# EAGLE design Quectel-2560-v2.1 (EAGLE 7.6.0)
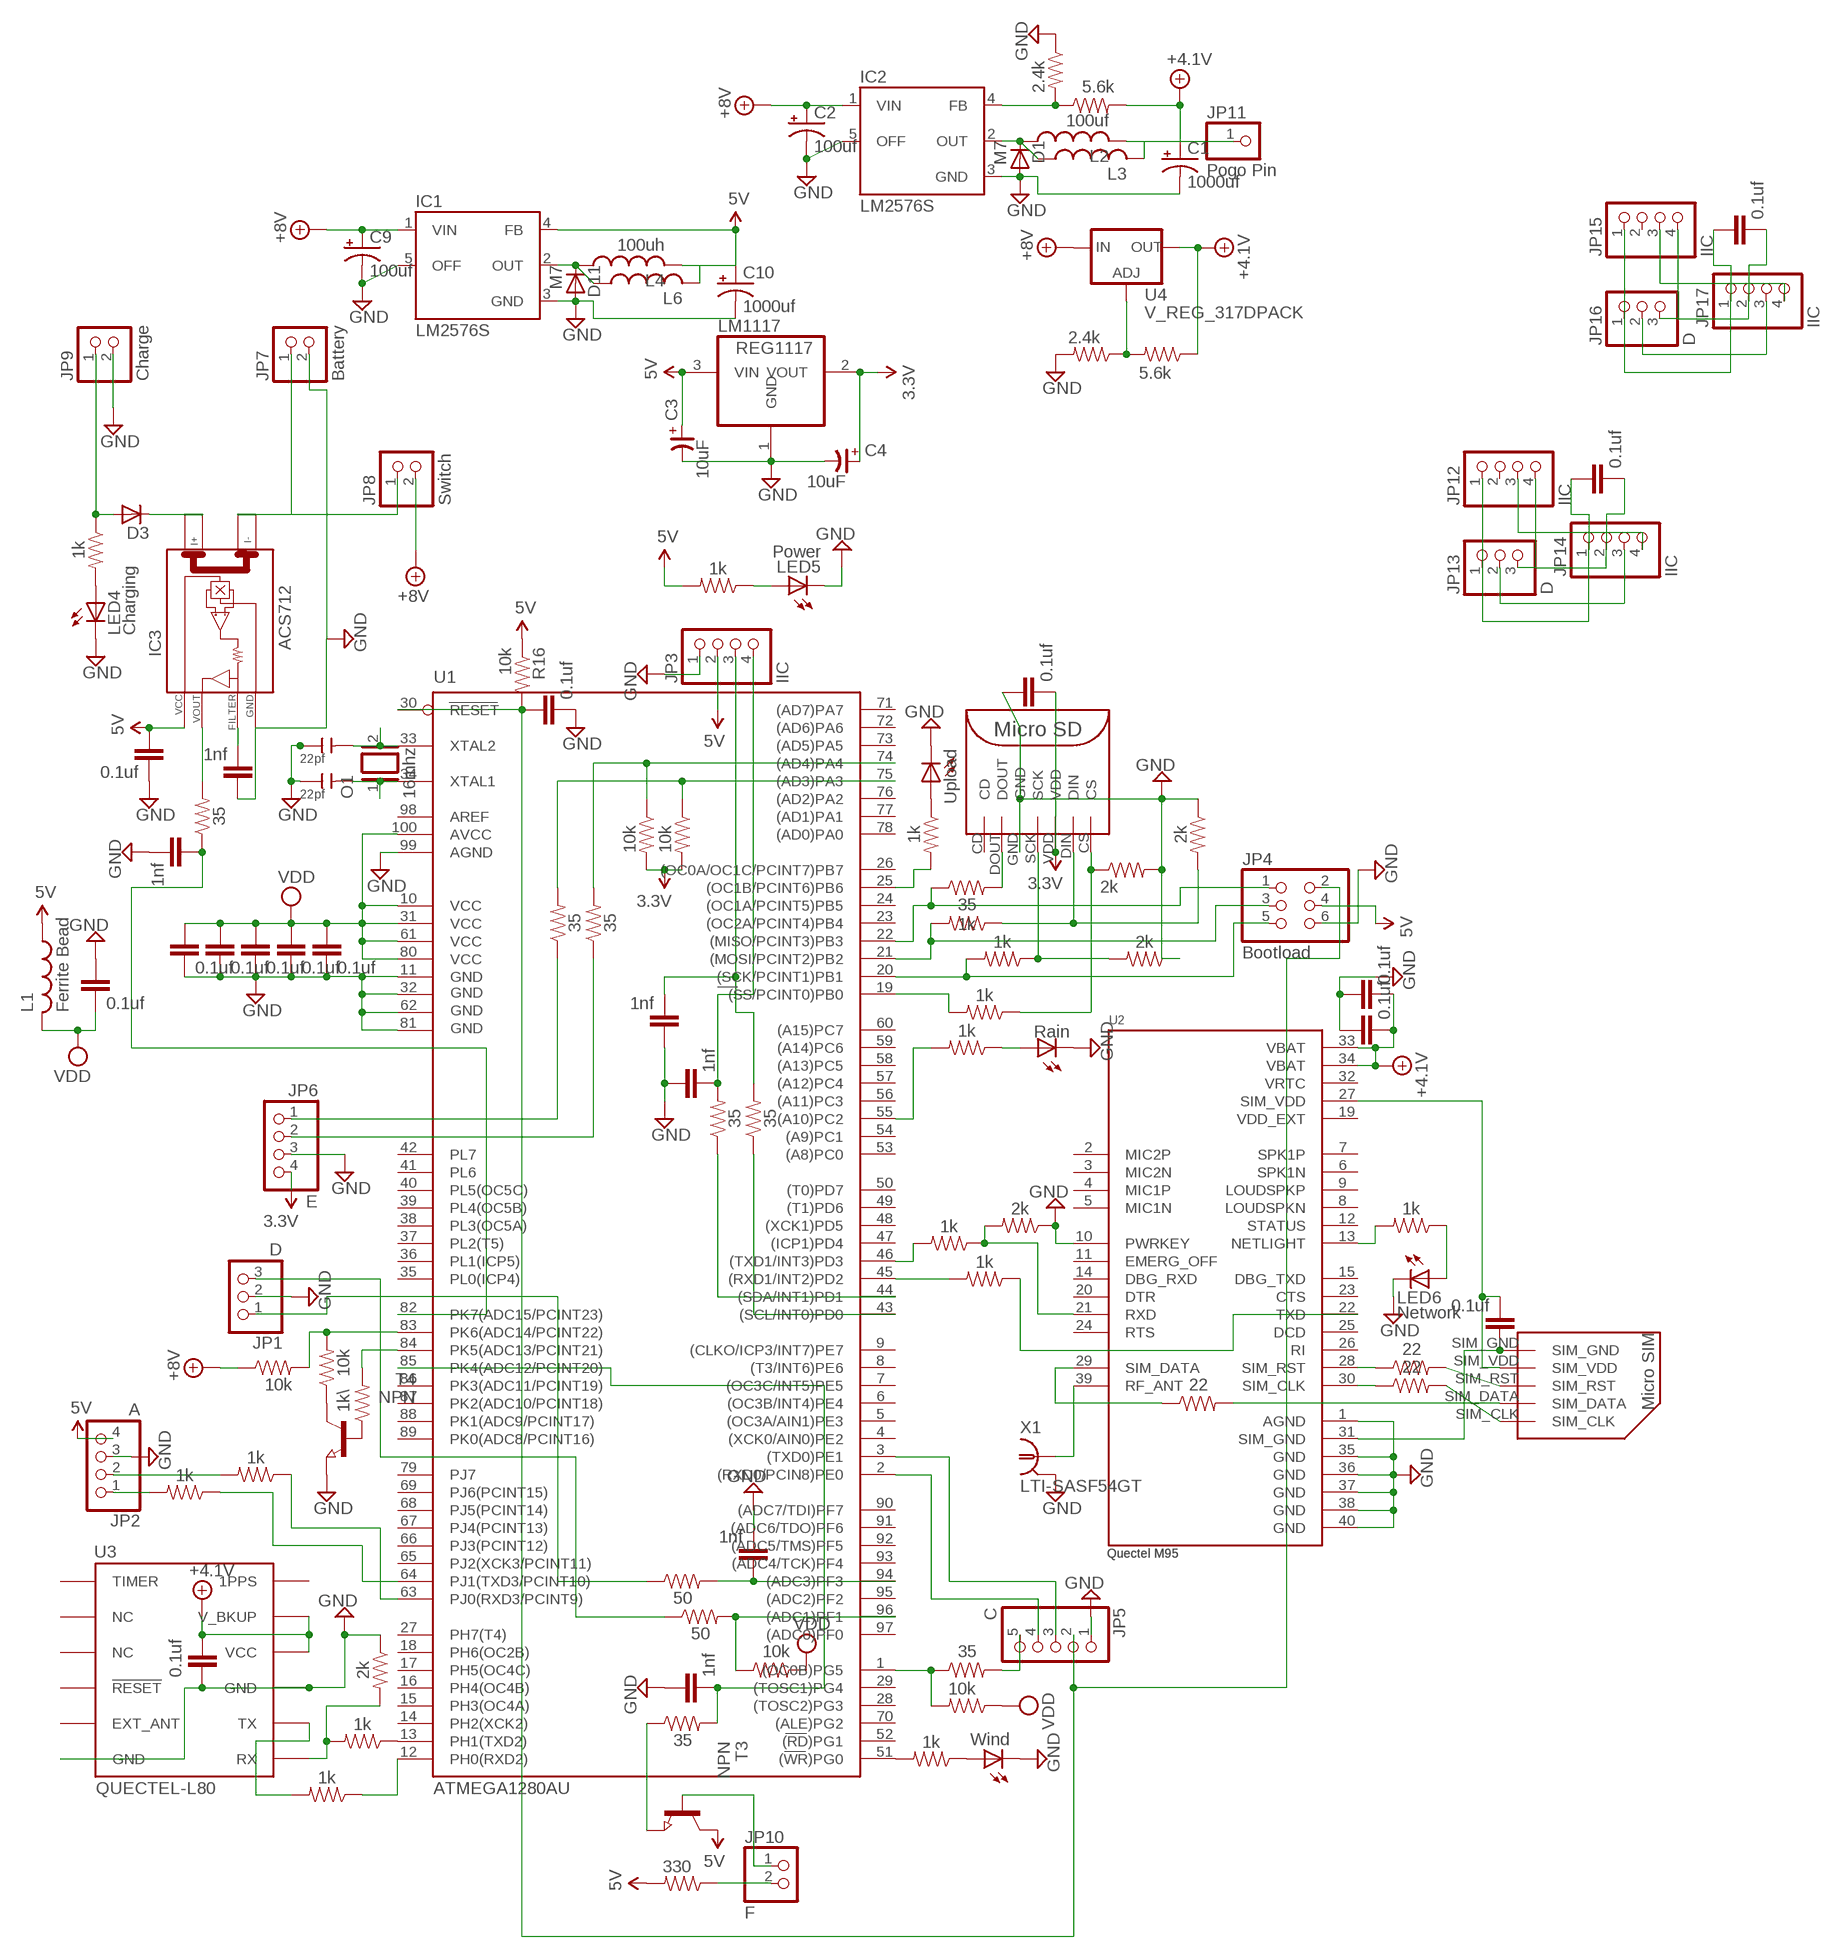
[diagram p0: schematic, sheet 1]

## Parts
C1  1000uf  CPOL-US153CLV-1012  [153CLV-1012]
C2  100uf  CPOL-USCT7343  [CT7343]
C3  10uF  CP-3528  [3528/T]
C4  10uF  CP-3528  [3528/T]
C7  22pf  CERAMIC-22PF-50V-5%-NPO(0805)  [C0805]
C8  22pf  CERAMIC-22PF-50V-5%-NPO(0805)  [C0805]
C9  100uf  CPOL-USCT7343  [CT7343]
C10  1000uf  CPOL-US153CLV-1012  [153CLV-1012]
D1  M7  BYS10  [SOD106A]
D3  BYS10  [SOD106A]
D11  M7  BYS10  [SOD106A]
DC1  0.1uf  C-EUC0805  [C0805]
DC2  0.1uf  C-EUC0805  [C0805]
DC3  0.1uf  C-EUC0805  [C0805]
DC4  0.1uf  C-EUC0805  [C0805]
DC5  0.1uf  C-EUC0805  [C0805]
DC6  0.1uf  C-EUC0805  [C0805]
DC7  0.1uf  C-EUC0805  [C0805]
DC8  0.1uf  C-EUC0805  [C0805]
DC9  0.1uf  C-EUC0805  [C0805]
DC10  0.1uf  C-EUC0805  [C0805]
DC11  0.1uf  C-EUC0805  [C0805]
DC12  1nf  C-EUC0805  [C0805]
DC13  1nf  C-EUC0805  [C0805]
DC14  1nf  C-EUC0805  [C0805]
DC15  0.1uf  C-EUC0805  [C0805]
DC16  0.1uf  C-EUC0805  [C0805]
DC17  1nf  C-EUC0805  [C0805]
DC18  0.1uf  C-EUC0805  [C0805]
DC19  0.1uf  C-EUC0805  [C0805]
DC20  1nf  C-EUC0805  [C0805]
DC21  1nf  C-EUC0805  [C0805]
IC1  LM2576S  [TO263-5]
IC2  LM2576S  [TO263-5]
IC3  ACS712  [SO08]
JP1  D  PINHD-1X3  [1X03]
JP2  A  PINHD-1X4  [1X04]
JP3  IIC  PINHD-1X4  [1X04]
JP4  Bootload  PINHD-2X3  [2X03]
JP5  C  PINHD-1X5  [1X05]
JP6  E  PINHD-1X4  [1X04]
JP7  Battery  PINHD-1X2  [1X02]
JP8  Switch  PINHD-1X2  [1X02]
JP9  Charge  PINHD-1X2  [1X02]
JP10  F  PINHD-1X2  [1X02]
JP11  Pogo Pin  PINHD-1X1  [1X01]
JP12  IIC  PINHD-1X4  [1X04]
JP13  D  PINHD-1X3  [1X03]
JP14  IIC  PINHD-1X4  [1X04]
JP15  IIC  PINHD-1X4  [1X04]
JP16  D  PINHD-1X3  [1X03]
JP17  IIC  PINHD-1X4  [1X04]
L1  Ferrite Bead  L-USL2012C  [L2012C]
L2  100uf  L-USPIS2816  [PIS2816]
L3  L-US6000-XXX-RC  [6000-XXXX-RC]
L4  100uh  L-USPIS2816  [PIS2816]
L6  L-US6000-XXX-RC  [6000-XXXX-RC]
LED1  Rain  LEDCHIP-LED0805  [CHIP-LED0805]
LED2  Upload  LEDCHIP-LED0805  [CHIP-LED0805]
LED3  Wind  LEDCHIP-LED0805  [CHIP-LED0805]
LED4  Charging  LEDCHIP-LED0805  [CHIP-LED0805]
LED5  Power  LEDCHIP-LED0805  [CHIP-LED0805]
LED6  Network  LEDCHIP-LED0805  [CHIP-LED0805]
LM1117  REG1117  [SOT223]
O1  16mhz  XTAL/S  [QS]
R1  35  RESISTOR0805-RES  [0805]
R4  2k  RESISTOR0805-RES  [0805]
R5  35  RESISTOR0805-RES  [0805]
R6  1k  RESISTOR0805-RES  [0805]
R7  1k  RESISTOR0805-RES  [0805]
R8  1k  RESISTOR0805-RES  [0805]
R9  2k  RESISTOR0805-RES  [0805]
R10  22  RESISTOR0805-RES  [0805]
R11  22  RESISTOR0805-RES  [0805]
R12  1k  RESISTOR0805-RES  [0805]
R13  1k  RESISTOR0805-RES  [0805]
R14  1k  RESISTOR0805-RES  [0805]
R15  1k  RESISTOR0805-RES  [0805]
R16  10k  RESISTOR0805-RES  [0805]
R17  1k  RESISTOR0805-RES  [0805]
R18  1k  RESISTOR0805-RES  [0805]
R19  35  RESISTOR0805-RES  [0805]
R20  10k  RESISTOR0805-RES  [0805]
R21  50  RESISTOR0805-RES  [0805]
R22  35  RESISTOR0805-RES  [0805]
R23  2k  RESISTOR0805-RES  [0805]
R24  2k  RESISTOR0805-RES  [0805]
R25  1k  RESISTOR0805-RES  [0805]
R26  1k  RESISTOR0805-RES  [0805]
R27  1k  RESISTOR0805-RES  [0805]
R28  1k  RESISTOR0805-RES  [0805]
R29  2k  RESISTOR0805-RES  [0805]
R30  35  RESISTOR0805-RES  [0805]
R31  50  RESISTOR0805-RES  [0805]
R32  1k  RESISTOR0805-RES  [0805]
R33  1k  RESISTOR0805-RES  [0805]
R34  10k  RESISTOR0805-RES  [0805]
R35  35  RESISTOR0805-RES  [0805]
R36  10k  RESISTOR0805-RES  [0805]
R39  35  RESISTOR0805-RES  [0805]
R40  10k  RESISTOR0805-RES  [0805]
R41  330  RESISTOR0805-RES  [0805]
R42  35  RESISTOR0805-RES  [0805]
R43  10k  RESISTOR0805-RES  [0805]
R44  10k  RESISTOR0805-RES  [0805]
R45  2.4k  RESISTOR0805-RES  [0805]
R46  5.6k  RESISTOR0805-RES  [0805]
R47  22  RESISTOR0805-RES  [0805]
R48  1k\  RESISTOR0805-RES  [0805]
R49  2.4k  RESISTOR0805-RES  [0805]
R50  5.6k  RESISTOR0805-RES  [0805]
T3  NPN  NPN-TRANSISTOR_SOT23  [SOT23]
T4  NPN  NPN-TRANSISTOR_SOT23  [SOT23]
U1  ATMEGA1280AU  ATMEGA2560AU  [TQFP100]
U2  Quectel M95  M95  [XCVR_M95]
U3  QUECTEL-L80  [QUECTEL-L80]
U4  V_REG_317DPACK  [V-REG_DPACK]
U$1  MICROSD  [MICROSD]
U$2  MICROSIM  [MICROSIM]
X1  LTI-SASF54GT  [LTI-SASF54GT]

## Nets
3.3V: C4.+ DC10.2 JP6.4 LM1117.2(VOUT) R34.2 R36.2 U$1.VDD
5V: C3.+ C10.+ DC19.2 IC1.4(FB) IC3.8(VCC) JP2.4 JP3.2 JP4.4 L1.1 L4.2 L6.2 LM1117.3(VIN) R16.1 R18.2 R41.2 T3.3(C)
+4.1V: C1.+ DC6.2 DC7.2 DC16.1 JP11.1 L2.2 L3.2 R46.2 R50.1 U2.33(VBAT) U2.34(VBAT) U3.4(VCC) U3.5(V_BKUP) U4.4(OUT)
+8V: C2.+ C9.+ IC1.1(VIN) IC2.1(VIN) JP8.2 R43.1 U4.3(IN)
GND: C1.- C2.- C3.- C4.- C7.1 C8.1 C9.- C10.- D1.A D11.A DC1.2 DC2.2 DC3.2 DC4.2 DC5.2 DC6.1 DC7.1 DC10.1 DC11.2 DC12.1 DC13.1 DC14.1 DC16.2 DC17.2 DC18.1 DC19.1 DC20.1 DC21.2 IC1.3(GND) IC1.5(OFF) IC2.3(GND) IC2.5(OFF) IC3.5(GND) JP1.2 JP2.3 JP3.1 JP4.6 JP5.1 JP6.3 JP7.2 JP9.2 LED1.C LED2.C LED3.C LED4.C LED5.C LED6.C LM1117.1(GND) R4.1 R9.1 R23.2 R24.1 R29.1 R45.1 R49.2 T4.2(E) U1.11(GND) U1.32(GND1) U1.62(GND2) U1.81(GND3) U1.99(AGND) U2.1(AGND) U2.10(PWRKEY) U2.35(GND) U2.36(GND) U2.37(GND) U2.38(GND) U2.40(GND) U3.3(GND) U3.12(GND) U$1.GND X1.2 X1.3 X1.4 X1.5
N$1: DC15.1 U2.31(SIM_GND) U$2.SIM_GND
N$2: DC15.2 U2.27(SIM_VDD) U$2.SIM_VDD
N$3: R10.1 U2.28(SIM_RST)
N$4: R11.1 U2.30(SIM_CLK)
N$5: DC8.1 JP12.1 JP13.1 JP14.1
N$6: R10.2 U$2.SIM_RST
N$7: LED2.A R25.1
N$8: JP5.4 U1.2((RXD0/PCIN8)PE0)
N$9: JP5.3 U1.3((TXD0)PE1)
N$10: R7.1 R24.2 U$1.SCK
N$11: DC12.2 JP3.4 R5.2
N$12: R6.1 R9.2 U$1.DIN
N$13: DC11.1 JP4.2 JP5.2 R16.2 U1.30(RESET)
N$14: DC8.2 JP12.4 JP13.3 JP14.2
N$15: JP13.2 JP14.3
N$16: JP4.3 R6.2 U1.21((MOSI/PCINT2)PB2)
N$17: JP4.5 R7.2 U1.20((SCK/PCINT1)PB1)
N$18: DC21.1 R1.1 U1.82(PK7(ADC15/PCINT23))
N$19: IC3.4(I-_1) JP7.1 JP8.1
N$20: R8.2 U1.19((SS/PCINT0)PB0)
N$21: U2.39(RF_ANT) X1.1
N$22: R22.2 R36.1 U1.75((AD3)PA3)
N$23: R5.1 U1.44((SDA/INT1)PD1)
N$25: D3.A JP9.1 R26.1
N$26: LED3.A R28.1
N$27: LED4.A R26.2
N$28: IC3.7(VOUT) R1.2
N$29: R11.2 U$2.SIM_CLK
N$30: C7.2 O1.2 U1.33(XTAL2)
N$31: C8.2 O1.1 U1.34(XTAL1)
N$32: DC13.2 JP3.3 R30.2
N$33: R28.2 U1.51((WR)PG0)
N$34: LED1.A R27.1
N$35: R8.1 R23.1 U$1.CS
N$36: R12.1 U1.13(PH1(TXD2))
N$37: R13.2 U3.2(TX)
N$38: R4.2 R12.2 U3.1(RX)
N$39: R25.2 U1.25((OC1B/PCINT6)PB6)
N$40: R14.2 U1.46((TXD1/INT3)PD3)
N$41: R15.2 U1.45((RXD1/INT2)PD2)
N$42: R14.1 R29.2 U2.21(RXD)
N$43: R15.1 U2.22(TXD)
N$44: R19.2 R34.1 U1.74((AD4)PA4)
N$45: JP5.5 R39.2
N$46: JP12.3 JP14.4
N$47: R20.1 R31.2 U1.96((ADC1)PF1)
N$48: R27.2 U1.55((A10)PC2)
N$49: JP4.1 R35.1 U1.22((MISO/PCINT3)PB3)
N$50: R17.2 U2.13(NETLIGHT)
N$51: LED6.A R17.1
N$52: JP6.1 R22.1
N$53: JP1.1 R21.1
N$54: DC17.1 R21.2 U1.94((ADC3)PF3)
N$55: R30.1 U1.43((SCL/INT0)PD0)
N$56: JP6.2 R19.1
N$57: JP1.3 R31.1
N$58: JP2.2 R32.2
N$60: LED5.A R18.1
N$61: JP10.2 R41.1
N$62: R32.1 U1.63(PJ0(RXD3/PCINT9))
N$63: JP2.1 R33.2
N$64: R35.2 U$1.DOUT
N$65: D11.K IC1.2(OUT) L4.1 L6.1
N$66: R33.1 U1.64(PJ1(TXD3/PCINT10))
N$67: R47.2 U$2.SIM_DATA
N$68: R47.1 U2.29(SIM_DATA)
N$69: R49.1 R50.2 U4.1(ADJ)
N$70: R13.1 U1.12(PH0(RXD2))
N$71: R39.1 R40.2 U1.1((OC0B)PG5)
N$72: DC9.1 JP15.1 JP16.1 JP17.1
N$73: JP10.1 T3.1(B)
N$74: R42.1 T3.2(E)
N$75: DC14.2 R42.2 U1.85(PK4(ADC12/PCINT20))
N$76: R43.2 R44.2 U1.83(PK6(ADC14/PCINT22))
N$77: D1.K IC2.2(OUT) L2.1 L3.1
N$78: IC2.4(FB) R45.2 R46.1
N$79: R44.1 T4.3(C)
N$80: R48.1 T4.1(B)
N$81: R48.2 U1.84(PK5(ADC13/PCINT21))
N$82: DC9.2 JP15.4 JP16.3 JP17.2
N$83: JP15.3 JP17.4
N$84: JP16.2 JP17.3
N$90: D3.K IC3.1(I+_0)
N$91: DC20.2 IC3.6(FILTER)
VDD: DC1.1 DC2.1 DC3.1 DC4.1 DC5.1 DC18.2 L1.2 R20.2 R40.1 U1.10(VCC) U1.31(VCC1) U1.61(VCC2) U1.80(VCC3) U1.100(AVCC)
Unconnected: IC3.2(I+_1) IC3.3(I-_0) JP12.2 JP15.2 U1.4((XCK0/AIN0)PE2) U1.5((OC3A/AIN1)PE3) U1.6((OC3B/INT4)PE4) U1.7((OC3C/INT5)PE5) U1.8((T3/INT6)PE6) U1.9((CLKO/ICP3/INT7)PE7) U1.14(PH2(XCK2)) U1.15(PH3(OC4A)) U1.16(PH4(OC4B)) U1.17(PH5(OC4C)) U1.18(PH6(OC2B)) U1.23((OC2A/PCINT4)PB4) U1.24((OC1A/PCINT5)PB5) U1.26((OC0A/OC1C/PCINT7)PB7) U1.27(PH7(T4)) U1.28((TOSC2)PG3) U1.29((TOSC1)PG4) U1.35(PL0(ICP4)) U1.36(PL1(ICP5)) U1.37(PL2(T5)) U1.38(PL3(OC5A)) U1.39(PL4(OC5B)) U1.40(PL5(OC5C)) U1.41(PL6) U1.42(PL7) U1.47((ICP1)PD4) U1.48((XCK1)PD5) U1.49((T1)PD6) U1.50((T0)PD7) U1.52((RD)PG1) U1.53((A8)PC0) U1.54((A9)PC1) U1.56((A11)PC3) U1.57((A12)PC4) U1.58((A13)PC5) U1.59((A14)PC6) U1.60((A15)PC7) U1.65(PJ2(XCK3/PCINT11)) U1.66(PJ3(PCINT12)) U1.67(PJ4(PCINT13)) U1.68(PJ5(PCINT14)) U1.69(PJ6(PCINT15)) U1.70((ALE)PG2) U1.71((AD7)PA7) U1.72((AD6)PA6) U1.73((AD5)PA5) U1.76((AD2)PA2) U1.77((AD1)PA1) U1.78((AD0)PA0) U1.79(PJ7) U1.86(PK3(ADC11/PCINT19)) U1.87(PK2(ADC10/PCINT18)) U1.88(PK1(ADC9/PCINT17)) U1.89(PK0(ADC8/PCINT16)) U1.90((ADC7/TDI)PF7) U1.91((ADC6/TDO)PF6) U1.92((ADC5/TMS)PF5) U1.93((ADC4/TCK)PF4) U1.95((ADC2)PF2) U1.97((ADC0)PF0) U1.98(AREF) U2.2(MIC2P) U2.3(MIC2N) U2.4(MIC1P) U2.5(MIC1N) U2.6(SPK1N) U2.7(SPK1P) U2.8(LOUDSPKN) U2.9(LOUDSPKP) U2.11(EMERG_OFF) U2.12(STATUS) U2.14(DBG_RXD) U2.15(DBG_TXD) U2.20(DTR) U2.23(CTS) U2.24(RTS) U2.25(DCD) U2.26(RI) U3.6(1PPS) U3.7(TIMER) U3.8(NC) U3.9(NC) U3.10(!RESET) U3.11(EXT_ANT) U$1.CD

## Power pins joined to a net without a drawn wire
VDD_EXT: U2.19(VDD_EXT)
VRTC: U2.32(VRTC)

## Library data of the parts
C1 C2 C9 C10 = rcl:CPOL-US: POLARIZED CAPACITOR, American symbol
C3 C4 = cap-master:CP-: POLARIZED CAP
C7 C8 = Seeed-OPL-Capacitor:CERAMIC-22PF-50V-5%-NPO(0805): 302010151; MPN: CC0805JRNPO9BN220
D1 D3 D11 = telefunken:BYS10: DIODE; MPN: BYS10/45; OC_FARNELL: 9549188; OC_NEWARK: 96K7236
DC1-DC21 = resistor:C-EU: CAPACITOR, European symbol
IC1 IC2 = lm2576:LM2576: National Semiconductor <http://www.national.com> 3.0A "Simple Switcher"(c) 52kHz, Vout 1.23-37V (HV: 57V), Vin 40V (HV: 60V), 50µA standby current
IC3 = ACS712:ACS712
JP1 JP13 JP16 = pinhead:PINHD-1X3: PIN HEADER
JP2 JP3 JP6 JP12 JP14 JP15 JP17 = pinhead:PINHD-1X4: PIN HEADER
JP4 = pinhead:PINHD-2X3: PIN HEADER
JP5 = pinhead:PINHD-1X5: PIN HEADER
JP7-JP10 = pinhead:PINHD-1X2: PIN HEADER
JP11 = pinhead:PINHD-1X1: PIN HEADER
L1-L4 L6 = rcl:L-US: INDUCTOR, American symbol
LED1-LED6 = led:LED: LED OSRAM: - CHIPLED LG R971, LG N971, LY N971, LG Q971, LY Q971, LO R971, LY R971 LH N974, LH R974 LS Q976, LO Q976, LY Q976 LO Q996 - Hyper CHIPLED LW Q18S LB Q993, LB Q99A, LB R99A - SideLED LS A670, LO A670, LY A670, LG A670, LP A670 LB A673, LV A673, LT A673, LW A673 LH A674 LY A675 LS A676, LA A676, LO A676, LY A676, LW A676 LS A679, LY A679, LG A679 - Hyper Micro SIDELED® LS Y876, LA Y876, LO Y876, LY Y876 LT Y87S - SmartLED LW L88C, LW L88S LB L89C, LB L89S, LG L890 LS L89K, LO L89K, LY L89K LS L896, LA L896, LO L896, LY L896 - TOPLED LS T670, LO T670, LY T670, LG T670, LP T670 LSG T670, LSP T670, LSY T670, LOP T670, LYG T670 LG T671, LOG T671, LSG T671 LB T673, LV T673, LT T673, LW T673 LH T674 LS T676, LA T676, LO T676, LY T676, LB T676, LH T676, LSB T676, LW T676 LB T67C, LV T67C, LT T67C, LS T67K, LO T67K, LY T67K, LW E67C LS E67B, LA E67B, LO E67B, LY E67B, LB E67C, LV E67C, LT E67C LW T67C LS T679, LY T679, LG T679 LS T770, LO T770, LY T770, LG T770, LP T770 LB T773, LV T773, LT T773, LW T773 LH T774 LS E675, LA E675, LY E675, LS T675 LS T776, LA T776, LO T776, LY T776, LB T776 LHGB T686 LT T68C, LB T68C - Hyper Mini TOPLED® LB M676 - Mini TOPLED Santana® LG M470 LS M47K, LO M47K, LY M47K Source: http://www.osram.convergy.de LUXEON: - LUMILED® LXK2-PW12-R00, LXK2-PW12-S00, LXK2-PW14-U00, LXK2-PW14-V00 LXK2-PM12-R00, LXK2-PM12-S00, LXK2-PM14-U00 LXK2-PE12-Q00, LXK2-PE12-R00, LXK2-PE12-S00, LXK2-PE14-T00, LXK2-PE14-U00 LXK2-PB12-K00, LXK2-PB12-L00, LXK2-PB12-M00, LXK2-PB14-N00, LXK2-PB14-P00, LXK2-PB14-Q00 LXK2-PR12-L00, LXK2-PR12-M00, LXK2-PR14-Q00, LXK2-PR14-R00 LXK2-PD12-Q00, LXK2-PD12-R00, LXK2-PD12-S00 LXK2-PH12-R00, LXK2-PH12-S00 LXK2-PL12-P00, LXK2-PL12-Q00, LXK2-PL12-R00 Source: www.luxeon.com KINGBRIGHT: KA-3528ASYC Source: www.kingbright.com
LM1117 = burr-brown:REG1117: 800mA and 1A Low Dropout (LDO) Positive Regulator 1.8V, 2.5V, 2.85V, 3.3V, 5V, and Adj; MPN: REG1117; OC_FARNELL: 1097566; OC_NEWARK: 14P6981
O1 = special:XTAL/S: CRYSTAL
R1 R4-R36 R39-R50 = SparkFun-Resistors:RESISTOR: Resistor Basic schematic elements and footprints for 0603, 1206, and PTH resistors.
T3 T4 = semicon-smd-ipc:NPN-TRANSISTOR_: NPN TRANSISTOR
U1 = SparkFun-DigitalIC:ATMEGA2560: Atmel 100-pin 8-bit uC 64/128/256 Kbytes FLASH 4 Kbytes EEPROM 8 Kbytes SRAM 86 General Purpose I/O pins 12-channels16-bit PWM 4 x Serial USARTs 16-channels 10-bit A/D; PROD_ID: IC-10040
U2 = M95:M95: Quad-Band GSM/GPRS Module LCC
U3 = quectel:QUECTEL-L80: Description: L80 is an ultra slim GPS POT (Patch on Top) module with an embedded 15.0 × 15.0 × 4.0mm patch antenna. This space-saving design makes L80 become the perpect module for the miniature devices. Adopted by LCC package and integrated with patch antenna, L80 has exceptional performance both in acquisition and tracking. Combining advanced AGPS called EASY™ (Embedded Assist System) and proven AlwaysLocate™ technology.
U4 = SparkFun-IC-Power:V_REG_317: Voltage Regulator Standard LM317 adjustable voltage regulator. AOI (Adjust Output Input). Google 'LM317 Calculator' for easy to use app to get the two resistor values needed. 240/720 for 5V output. 240/390 for 3.3V output. Spark Fun Electronics SKU : COM-00527; PROD_ID: IC-09888
U$1 = MicroSD:MICROSD
U$2 = MicroSD:MICROSIM
X1 = con-coax:LTI-SASF54GT: SMA vertical PCB thrue hole jack Source: Lighthorse Technologies, inc. SASF54GT.pdf; OC_FARNELL: unknown; OC_NEWARK: unknown

## Net classes
0 default: clearance 0.205 mm

## Board
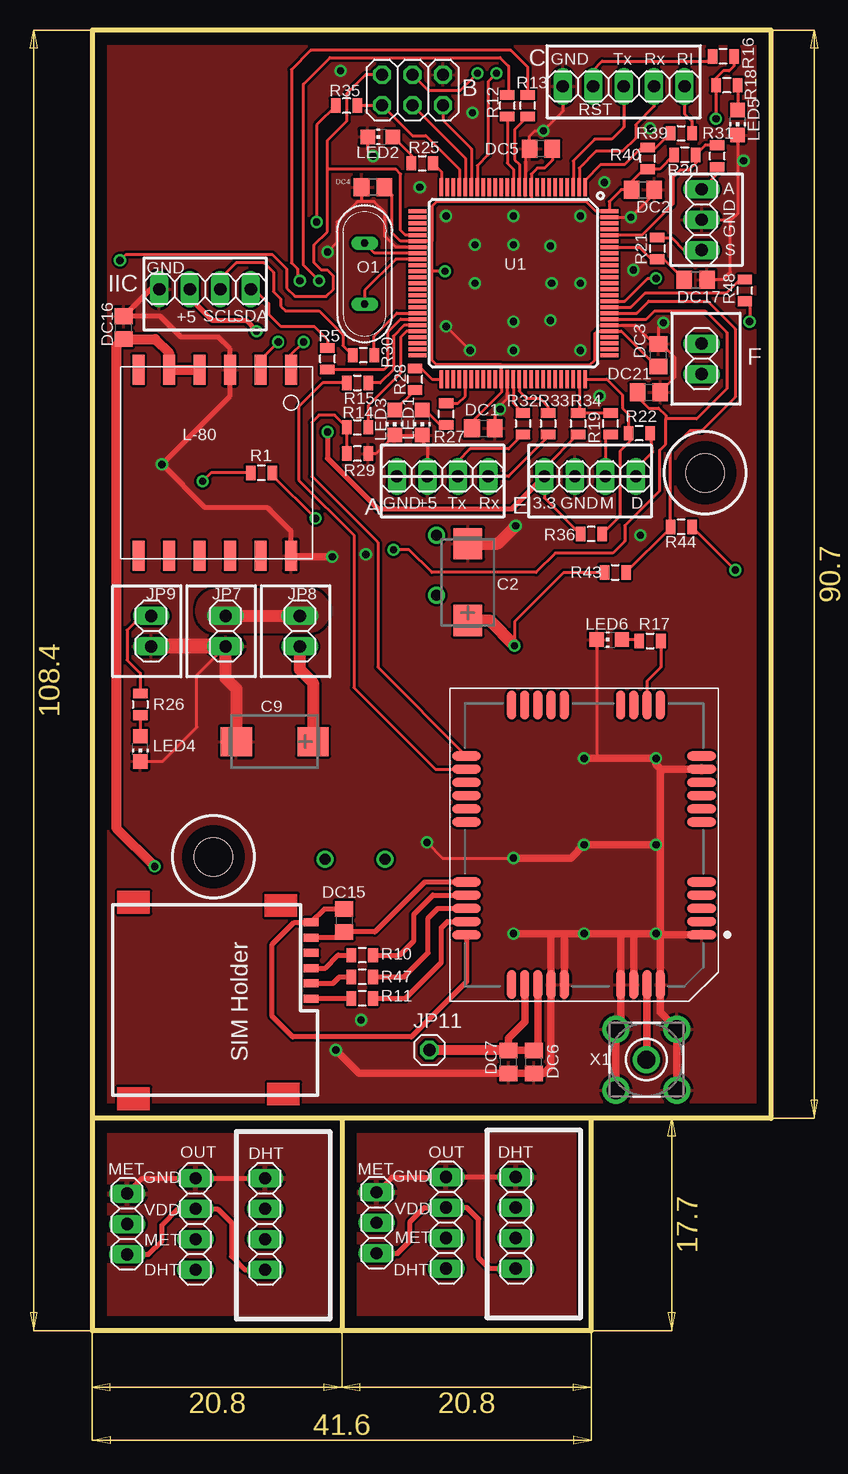
[diagram p1: board, top side]
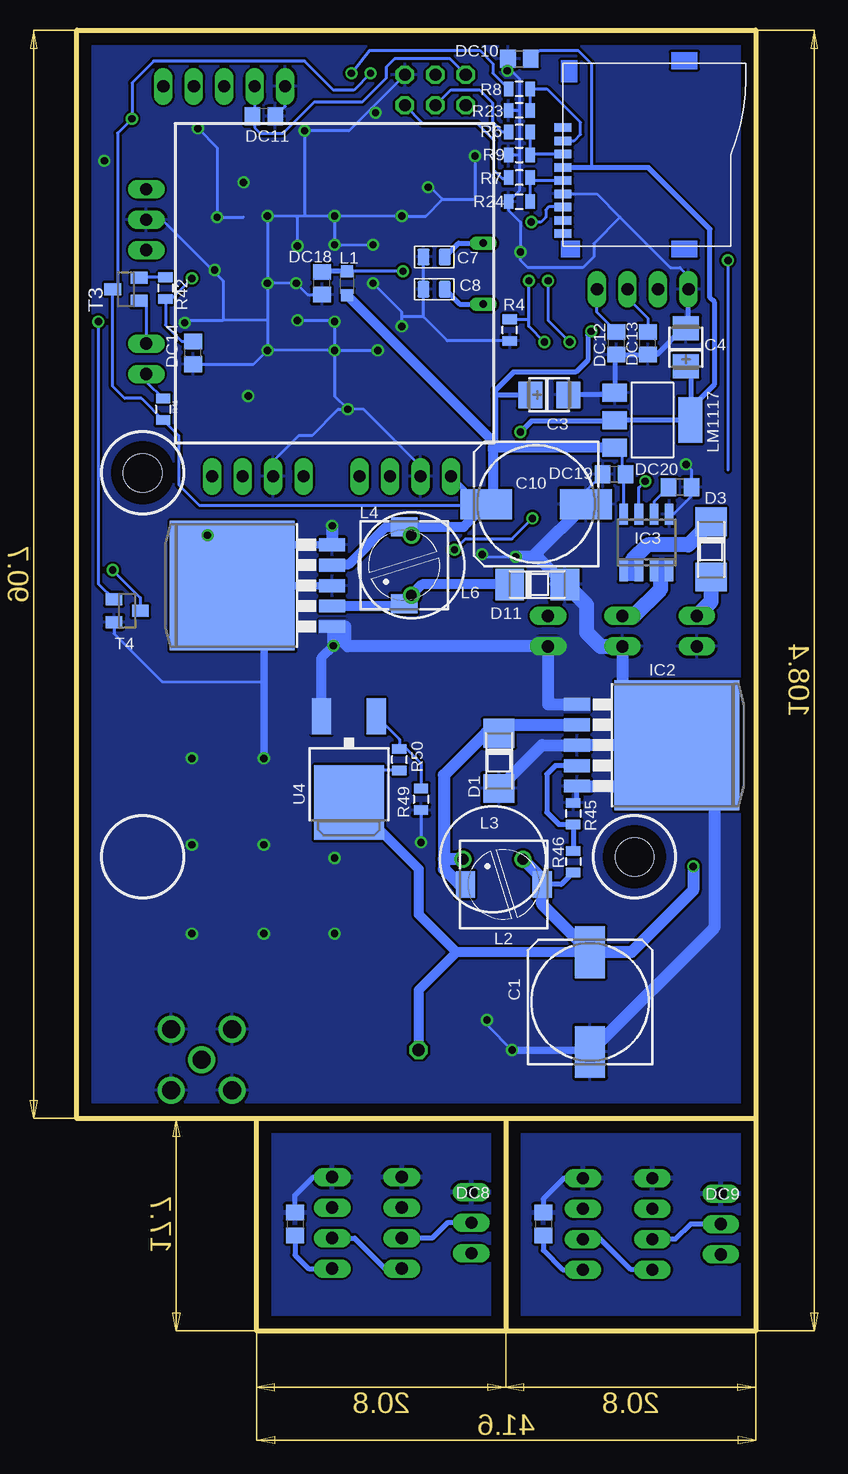
[diagram p2: board, bottom side, seen from below]

Size 56.6 x 108.4 mm. Coordinates in mm from the lower left corner, seen from the top.
Outline: 41.6,17.7 56.6,17.7 56.6,108.4 0,108.4 0,17.7
Outline: 41.6,17.7 20.8,17.7
Outline: 20.8,17.7 0,17.7
Outline: 20.8,0 41.6,0 41.6,17.7
Outline: 20.8,0 0,0 0,17.7
Outline: 20.8,17.7 20.8,0
Copper layers (1*16): Top 0.035mm / dielectric 1mm / Bottom 0.035mm
Design rules "Quectel-2560-v2.1": minimum track width 10mil, minimum drill 24mil, track to track 0.205mm, track to pad 0.205mm, pad to pad 0.205mm, via to via 0.205mm, smd to smd 8mil, copper to edge 40mil, drill to drill 8mil, minimum pad ring 10mil, minimum via ring 8mil, stop-mask expansion 4mil, vias tented up to drill 0mil, thermal gap 10mil
Holes 3.2 mm at 10.1,39.5 51.1,71.5

### Footprints (pad centres in the part's own frame; a part is rotated, then mirrored left to right if it is on the bottom)
153CLV-1012 = smd 4.3 x 2.5: + 4.15,0; - -4.15,0
CT7343 = smd 2.6 x 2.4: + -3.2,0; - 3.2,0
3528/T = smd 2 x 2.2: + 1.587,0; - -1.587,0
C0805 = smd 1.397 x 1.016: 1 0,0.889; 2 0,-0.889
SOD106A = smd 2.4 x 2.6: A 2.3,0; K -2.3,0
C0805' = smd 1.3 x 1.5: 1 -0.95,0; 2 0.95,0
TO263-5 = smd 1.067 x 2.159: 1 -3.404,-5.791; 2 -1.702,-5.791; 3 0,-5.791; 4 1.702,-5.791; 5 3.404,-5.791 | smd 10.8 x 10.41: 6 0,2.54
SO08 = smd 0.72 x 1.78: 1 -1.905,-2.35; 2 -0.635,-2.35; 3 0.635,-2.35; 4 1.905,-2.35; 5 1.905,2.35; 6 0.635,2.35; 7 -0.635,2.35; 8 -1.905,2.35
1X03 = drill 1.016 long: 1 -2.54,0; 2 0,0; 3 2.54,0
1X04 = drill 1.016 long: 1 -3.81,0; 2 -1.27,0; 3 1.27,0; 4 3.81,0
2X03 = drill 1.016 octagon: 1 -2.54,-1.27; 2 -2.54,1.27; 3 0,-1.27; 4 0,1.27; 5 2.54,-1.27; 6 2.54,1.27
1X05 = drill 1.016 long: 1 -5.08,0; 2 -2.54,0; 3 0,0; 4 2.54,0; 5 5.08,0
1X02 = drill 1.016 long: 1 -1.27,0; 2 1.27,0
1X01 = drill 1.016 octagon: 1 0,0
L2012C = smd 1 x 1: 1 -1,0; 2 1,0
PIS2816 = smd 2.2 x 1.6: 1 0,3.2; 2 0,-3.2
6000-XXXX-RC = drill 0.9 pad 1.422: 1 -2.5,0; 2 2.5,0
CHIP-LED0805 = smd 1.2 x 1.2: A 0,-1.05; C 0,1.05
SOT223 = smd 1.499 x 2.007: 1 -2.261,-3.15; 2 0.025,-3.15; 3 2.311,-3.15 | smd 3.81 x 2.007: 4 0,3.15
QS = drill 0.61 long: 1 -2.54,0; 2 2.54,0
0805 = smd 0.8 x 1.2: 1 -0.9,0; 2 0.9,0
SOT23 = smd 1 x 1.4: 1 -0.95,-1.1; 2 0.95,-1.1; 3 0,1.1
TQFP100 = smd 1.5 x 0.3: 1 -8,6; 2 -8,5.5; 3 -8,5; 4 -8,4.5; 5 -8,4; 6 -8,3.5; 7 -8,3; 8 -8,2.5; 9 -8,2; 10 -8,1.5; 11 -8,1; 12 -8,0.5; 13 -8,0; 14 -8,-0.5; 15 -8,-1; 16 -8,-1.5; 17 -8,-2; 18 -8,-2.5; 19 -8,-3; 20 -8,-3.5; 21 -8,-4; 22 -8,-4.5; 23 -8,-5; 24 -8,-5.5; 25 -8,-6; 51 8,-6; 52 8,-5.5; 53 8,-5; 54 8,-4.5; 55 8,-4; 56 8,-3.5; 57 8,-3; 58 8,-2.5; 59 8,-2; 60 8,-1.5; 61 8,-1; 62 8,-0.5; 63 8,0; 64 8,0.5; 65 8,1; 66 8,1.5; 67 8,2; 68 8,2.5; 69 8,3; 70 8,3.5; 71 8,4; 72 8,4.5; 73 8,5; 74 8,5.5; 75 8,6 | smd 0.3 x 1.5: 26 -6,-8; 27 -5.5,-8; 28 -5,-8; 29 -4.5,-8; 30 -4,-8; 31 -3.5,-8; 32 -3,-8; 33 -2.5,-8; 34 -2,-8; 35 -1.5,-8; 36 -1,-8; 37 -0.5,-8; 38 0,-8; 39 0.5,-8; 40 1,-8; 41 1.5,-8; 42 2,-8; 43 2.5,-8; 44 3,-8; 45 3.5,-8; 46 4,-8; 47 4.5,-8; 48 5,-8; 49 5.5,-8; 50 6,-8; 76 6,8; 77 5.5,8; 78 5,8; 79 4.5,8; 80 4,8; 81 3.5,8; 82 3,8; 83 2.5,8; 84 2,8; 85 1.5,8; 86 1,8; 87 0.5,8; 88 0,8; 89 -0.5,8; 90 -1,8; 91 -1.5,8; 92 -2,8; 93 -2.5,8; 94 -3,8; 95 -3.5,8; 96 -4,8; 97 -4.5,8; 98 -5,8; 99 -5.5,8; 100 -6,8
XCVR_M95 = smd 2.4 x 0.75: 1 -9.8,7.5; 2 -9.8,6.4; 3 -9.8,5.3; 4 -9.8,4.2; 5 -9.8,3.1; 6 -9.8,-1.9; 7 -9.8,-3; 8 -9.8,-4.1; 9 -9.8,-5.2; 10 -9.8,-6.3; 11 -9.8,-7.4; 21 9.8,-7.4; 22 9.8,-6.3; 23 9.8,-5.2; 24 9.8,-4.1; 25 9.8,-3; 26 9.8,-1.9; 27 9.8,3.1; 28 9.8,4.2; 29 9.8,5.3; 30 9.8,6.4; 31 9.8,7.5 | smd 0.75 x 2.4: 12 -6.35,-11.65; 13 -5.25,-11.65; 14 -4.15,-11.65; 15 -3.05,-11.65; 16 1.65,-11.65; 17 2.75,-11.65; 18 3.85,-11.65; 19 4.95,-11.65; 20 6.05,-11.65; 32 6.05,11.65; 33 4.95,11.65; 34 3.85,11.65; 35 2.75,11.65; 36 1.65,11.65; 37 -3.05,11.65; 38 -4.15,11.65; 39 -5.25,11.65; 40 -6.35,11.65
QUECTEL-L80 = smd 2.5 x 1: 1 7.59,-6.36; 2 7.59,-3.82; 3 7.59,-1.28; 4 7.59,1.26; 5 7.59,3.8; 6 7.59,6.34; 7 -7.91,6.34; 8 -7.91,3.8; 9 -7.91,1.26; 10 -7.91,-1.28; 11 -7.91,-3.82; 12 -7.91,-6.36
V-REG_DPACK = smd 1.6 x 3: 1 -2.28,-4.8; 3 2.28,-4.8 | smd 5.8 x 6.2: 4 0,2.38
MICROSD = smd 1.422 x 0.711: CD -6.35,-6.553; CS -6.35,1.143; DIN -6.35,0.051; DOUT -6.35,-4.343; GND -6.35,-3.251; P$3 -6.35,2.261; P$8 -6.35,-4.343; P$9 -6.35,-4.343; P$10 -6.35,-5.461; SCK -6.35,-2.159; VDD -6.35,-1.041
MICROSIM = smd 0.66 x 1.27: NC -3.29,9.23; SIM_CLK 0.515,9.23; SIM_DATA -0.76,9.23; SIM_GND -5.83,9.23; SIM_RST -2.025,9.23; SIM_VDD -4.565,9.23
LTI-SASF54GT = drill 1.5 pad 2.2: 1 0,0; 2 -2.54,2.54; 3 2.54,2.54; 4 2.54,-2.54; 5 -2.54,-2.54

### Placement (x,y rotation side)
C1  13.8,27.4 90 bottom
C2  31.3,62.4 90 top
C3  17.2,78 180 bottom
C4  5.81,81.96 270 bottom
C7  26.8,89.49 90 bottom
C8  26.8,86.8 90 bottom
C9  15.2,49.1 180 top
C10  18.3,68.9 180 bottom
D1  21.4,47.5 270 bottom
D3  3.71,65.11 270 bottom
D11  18.2,62.2 0 bottom
DC1  0.1uf  [C0805']  32.6,75.2 0 top
DC2  0.1uf  [C0805']  45.9,95.1 0 top
DC3  0.1uf  [C0805']  47.2,81.3 90 top
DC4  0.1uf  [C0805']  23.4,95.3 180 top
DC5  0.1uf  [C0805']  37.4,98.5 180 top
DC6  0.1uf  [C0805']  36.8,22.4 90 top
DC7  0.1uf  [C0805']  34.7,22.4 90 top
DC8  0.1uf  [C0805']  38.4,8.9 270 bottom
DC9  0.1uf  [C0805']  17.7,8.9 270 bottom
DC10  0.1uf  [C0805']  19.7,106 0 bottom
DC11  0.1uf  [C0805']  41,101.2 0 bottom
DC12  1nf  [C0805']  11.6,82.3 90 bottom
DC13  1nf  [C0805']  9,82.3 90 bottom
DC14  1nf  [C0805']  46.9,81.5 90 bottom
DC15  0.1uf  [C0805']  21,34.2 270 top
DC16  0.1uf  [C0805']  2.6,83.6 90 top
DC17  1nf  [C0805']  50.3,87.6 0 top
DC18  0.1uf  [C0805']  36.15,87.3 90 bottom
DC19  0.1uf  [C0805']  11.8,71.4 0 bottom
DC20  1nf  [C0805']  6.3,70.3 180 bottom
DC21  1nf  [C0805']  46.4,78.2 0 top
IC1  41.1,62.1 90 bottom
IC2  9.1,48.8 270 bottom
IC3  9.1,65.7 0 bottom
JP1  50.8,92.6 90 top
JP2  29.2,71.2 180 top
JP3  9.4,86.8 0 top
JP4  26.7,103.4 0 top
JP5  44.3,103.7 0 top
JP6  41.5,71.2 180 top
JP7  11.1,58.3 270 top
JP8  17.3,58.3 270 top
JP9  4.9,58.3 270 top
JP10  50.8,81 270 top
JP11  28.1,23.4 0 top
JP12  35.3,9 270 top
JP13  23.7,9 270 top
JP14  29.5,9 270 top
JP15  14.4,8.9 270 top
JP16  2.9,8.9 270 top
JP17  8.6,8.9 270 top
L1  34.05,87.3 90 bottom
L2  21,37.2 90 bottom
L3  21.9,39.3 0 bottom
L4  29.3,63.8 180 bottom
L6  28.7,63.8 90 bottom
LED1  27.5,75.7 180 top
LED2  24,99.5 90 top
LED3  25.2,75.7 180 top
LED4  4,48.5 180 top
LED5  53.8,100.7 180 top
LED6  43.1,57.6 90 top
LM1117  8.6,75.9 270 bottom
O1  22.7,88.1 90 top
R1  14.1,71.5 180 top
R4  20.5,83.4 90 bottom
R5  19.6,81 90 top
R6  19.7,99.9 180 bottom
R7  19.7,96.1 180 bottom
R8  19.7,103.5 180 bottom
R9  19.7,98 0 bottom
R10  22.5,31.3 180 top
R11  22.5,27.7 180 top
R12  34.6,102.1 90 top
R13  36.3,102.1 90 top
R14  22.1,75.3 0 top
R15  22.1,79 0 top
R16  52.6,106.2 180 top
R17  46.5,57.5 0 top
R18  52.9,103.8 180 top
R19  43.2,75.6 90 top
R20  49.4,98 180 top
R21  47.1,90.2 270 top
R22  45.6,74.8 180 top
R23  19.7,101.7 180 bottom
R24  19.7,94.1 0 bottom
R25  27.5,97.3 0 top
R26  4,52.2 270 top
R27  29.5,76.4 90 top
R28  26.9,79.3 90 top
R29  22.1,73.1 180 top
R30  22.6,81.3 180 top
R31  52.1,97.9 90 top
R32  35.9,75.6 270 top
R33  38,75.6 270 top
R34  40.5,75.6 270 top
R35  21.2,102.1 180 top
R36  41.6,66.4 180 top
R39  49.1,99.8 0 top
R40  46.3,97.7 90 top
R41  49.4,76.8 270 bottom
R42  49.2,86.9 270 bottom
R43  43.6,63.2 0 top
R44  49.1,67 180 top
R45  15.2,43.1 270 bottom
R46  15.2,39.1 270 bottom
R47  22.5,29.5 180 top
R48  54.4,86.7 90 top
R49  27.9,44.3 270 bottom
R50  29.7,47.6 90 bottom
T3  52.5,86.8 90 bottom
T4  52.4,60 270 bottom
U1  35.1,87.3 270 top
U2  41,40.5 180 top
U3  10.2,72.5 90 top
U4  33.9,46.4 180 bottom
U$1  9.7,98 0 bottom
U$2  9,28.2 270 top
X1  46.2,22.6 0 top

### Tracks (layer width: path | path; a pad name or v marks a point on that pad's centre or on a via)
3.3V  (via drill 0.6)
  Top 0.254: R36.2 37.69,69.41 JP6.4 37.69,71.89 R34.2
  Top 0.406: v19.6,74.9 19.6,72.7 23.8,68.5 34.99,68.5 JP6.4
  Bottom 0.254: 13.7,96.96 13.7,105.6 14.8,106.7 18,106.7 18.7,106 DC10.2
  Bottom 0.406: 13.7,96.96 U$1.VDD 8.96,96.96 3.8,91.8 3.8,86.1 3.4,85.7 3.4,78.88 5.39,76.89 | 5.39,76.89 5.85,76.45 6.33,75.88 LM1117.2 11.82,75.8 18.7,75.8 v19.6,74.9 | C4.+ 5.39,79.95 5.39,76.89
5V  (via drill 0.6)
  Top 0.254: JP4.4 27.97,103.4 30.7,103.4 v32.1,104.8 | R16.1 53.5,105.4 53.1,105 52.6,105 52,104.4 R18.2 v52,101
  Top 0.406: JP3.2 8.13,86.07 10,84.2 12.8,84.2 v13.7,83.3
  Bottom 0.254: v32.1,104.8 33.5,103.4 35.2,103.4 37.6,105.8 50.2,105.8 52,104 v52,101 53.2,99.8 53.2,86.8 | 53.2,86.8 T3.3 53.6,78.7 52.6,77.7 51.2,77.7 R41.2 48.1,74.6 48.1,70.5 46.4,68.8 22,68.8 21.9,68.9 | 53.2,86.8 53.6,86.4 | IC3.8 11.01,71.25 DC19.2 11.1,71.65 11.1,73 11.69,73.59 LM1117.3
  Bottom 0.406: C10.+ 21.9,68.9 21.6,68.9 | JP2.4 23.09,68.9 C10.+ | 21.7,77.9 21.7,78.4 20.2,79.9 15,79.9 14,80.9 14,83 v13.7,83.3 | 22.9,69.35 C10.+ | 21.7,77.9 21.6,78 C3.+ | 21.7,77.9 21.7,73.8 21.9,73.6
  Bottom 0.61: 22.65,68.7 C10.+ | 35.21,63.9 IC1.4
  Bottom 0.813: L1.1 21.9,74.15 21.9,73.6 21.9,73.4 | 21.9,73.4 21.9,68.9 | LM1117.3 21.71,73.59 21.9,73.4 | 35.21,63.9 33.9,63.9 30.8,67 L4.2 | L4.2 28.7,66.4 L6.2 | L4.2 24.35,67 C10.+
+4.1V  (via drill 0.6)
  Top 0.61: DC6.2 37.15,23.6 U2.34 37.15,23.3 | U2.33 36.05,25.75 34.7,24.4 DC7.2 34.75,23.4 36.75,23.4
  Top 0.813: v5.2,38.7 2,41.9 2,82.05 DC16.1 5.25,82.65 6.4,81.5 U3.5 U3.4 | DC7.2 34.65,23.4 JP11.1 | 36.75,23.4 DC6.2
  Bottom 0.254: R50.1 31.22,46.7 U4.4
  Bottom 0.406: R46.2 16.2,37.2 L2.2
  Bottom 0.813: C1.+ 24.95,31.55 | U4.4 33.62,44.02 28.1,38.5 28.1,34.7 24.95,31.55 | 24.95,31.55 28.1,28.4 JP11.1
  Bottom 1.016: 13.8,31.9 C1.+ | v5.2,38.7 5.2,36.7 10.35,31.55 C1.+ | C1.+ 17.8,35.55 L2.2 17.8,37.7 L3.2
+8V  (via drill 0.6)
  Top 0.254: v35.2,57.1 35.2,59.1 39.3,63.2 R43.1
  Top 1.016: JP8.2 17.3,55.1 18.4,54 C9.+ | C2.+ 33.1,59.2 v35.2,57.1
  Bottom 0.813: U4.3 36.18,56.12 v35.2,57.1
  Bottom 1.016: IC2.1 17.3,52.2 JP8.2 34,57.03 34.2,57.23 34.2,58.7 IC1.1 35.2,58.59 v35.2,57.1
  pour Bottom (no thermals): 13.8,51.6 13.8,55.6 16,57.8 21,57.8 22.4,59.2 36.4,59.2 36.4,56.7 37.6,55.5 37.6,50.3 37.1,49.8 35.2,49.8 34.7,50.3 34.7,52.7 33.7,53.7 26.9,53.7 24.8,51.6
GND  (via drill 0.6)
  Top 0.254: U1.99 v44.9,92.8 46.85,94.75 DC2.2 | U1.62 34.6,77.7 34,77.1 v34,76.8 33.55,76.35 DC1.2 33.5,75.25 | U1.32 25.3,90.3 24.4,91.2 24.4,93.2 23.5,94.1 22.45,94.1 | 22.45,94.1 22.1,94.1 20.4,92.4 20.4,90.7 v19.6,89.9 | DC4.2 22.45,94.1 | LED2.C 22.95,98.35 v23.4,97.9 | U1.81 45.25,83.8 46.8,82.25 DC3.2 | JP5.1 39.22,101.62 v37.6,100 36.9,100 36.45,99.55 DC5.2 36.1,98.15 U1.11 | JP2.3 27.93,73.72 27.5,74.15 LED1.C LED3.C 23.65,73.1 R29.1 | 53.2,92.5 53.2,88.25 52.55,87.6 DC17.2 | 53.2,92.5 53.2,92.6 JP1.2 | LED6.C 42.05,47.75 42,47.7 | LED4.C 5.85,47.45 8.7,50.3 8.7,54.63 JP7.2 | LED5.C 53.8,93.1 53.2,92.5 | v47.6,84 47.2,83.6 DC3.2 | v29.5,83.7 v31.5,81.7 | v27.9,40.7 29.2,39.4 v35.1,39.4 | DC3.2 47.45,82.25 48.6,81.1 48.6,79.5 47.35,78.25 DC21.2
  Top 0.406: JP3.1 4.85,86.8 DC16.2 5.65,84.55 7.4,82.8 10.5,82.8 11.48,81.82 U3.3 11.48,77.88 v5.8,72.2 9.4,68.6 14.6,68.6 16.56,66.64 U3.12
  Top 0.61: 47.35,33.1 U2.40 47.35,26.53 X1.3 X1.4 | U2.38 45.15,33.1 | 45.15,33.1 v47,33.1 | v47,33.1 47.35,33.1 | 44.05,33.1 U2.37 44.05,25.53 X1.2 X1.5 | 44.05,33.1 45.15,33.1 | U2.36 39.35,33.1 | 39.35,33.1 v41,33.1 44.05,33.1 | 38.3,33.1 38.25,33 U2.35 38.25,22.05 37.65,21.45 DC6.1 DC7.1 22.25,21.45 v20.3,23.4 | 38.3,33.1 39.35,33.1 | U2.10 47.4,46.8 | 47.4,46.8 47.35,46.8 47.35,40.4 | 47.35,40.4 47.35,33.1 | U3.12 16.65,64.5 v20,64.5 | v35.1,33.1 38.3,33.1 | U2.1 47.1,33 v47,33.1 | 47.35,40.4 47.25,40.5 v47,40.5 v41,40.5 39.9,39.4 v35.1,39.4 | v41,47.7 42,47.7 v47,47.7 47,47.2 47.4,46.8
  Top 1.016: JP7.2 11.1,54.4 12,53.5 C9.- | C2.- 33.8,65.6 v35.3,67.1
  Top 1.27: JP7.2 JP9.2
  Bottom 0.254: C8.1 C7.1 | C8.1 27.79,86.6 | v44.9,92.8 42.7,92.8 | 5.59,86.56 JP3.1 5.59,87.89 6.3,88.6 7.1,88.6 11.3,92.8 | 19.7,101.7 19.7,104.35 20.65,105.3 DC10.1 | 19.7,101.7 19.7,98 | 19.7,98 19.7,95 R24.1 20.6,93.4 19.6,92.4 v19.6,89.9 19.6,89.2 19,88.6 14.4,88.6 13.5,89.5 13.5,90.6 11.3,92.8 | 44.8,92.9 v44.9,92.8 | 26.1,94.3 27.5,92.9 v29.5,92.9 v35.1,92.9 | v34,76.8 32.7,76.8 27.93,72.03 JP2.3 | v34,76.8 34.8,76.8 37,74.6 38.1,74.6 40.23,72.47 JP6.3 | v23.4,97.9 23.4,94.3 26.1,94.3 | v46.5,100.2 44.9,98.6 v44.9,92.8 | DC11.2 39.22,102.03 JP5.1 | 40.7,84.2 44.4,84.2 | JP1.2 49.5,92.6 44.4,87.5 44.4,84.2 | v34,76.8 35.1,77.9 v35.1,81.7 | JP4.6 33.91,100 v37.6,100 37.6,92.9 v35.1,92.9 | v22.8,64.7 22.6,64.5 v20,64.5 | v22.4,25.9 22.4,25.5 v20.3,23.4 | U$1.GND 13.25,94.75 11.3,92.8 | v47.6,84 47.4,84.2 44.4,84.2 | T4.2 53.5,58.1 49.5,54.1 41,54.1 | 36.5,86.7 DC18.1 37.35,86.35 v38.3,87.3 v40.7,87.3 | v27.3,95.3 27.1,95.3 26.1,94.3 | R4.1 25.7,82.5 27.69,84.49 | 27.69,84.49 C8.1 | v35.1,92.9 38.2,92.9 | 38.2,92.9 v40.7,92.9 v40.7,87.3 | v40.7,87.3 40.7,84.2 | 40.7,84.2 v40.7,81.7 | v35.1,81.7 v40.7,81.7 | v35.1,81.7 v35.1,84.1 35.1,84.2 v38.2,84.2 | v35.1,92.9 v35.1,90.5 v31.9,90.5 | v38.2,90.4 38.2,92.9 | v29.5,83.7 29.5,84.5 | 29.5,84.5 29.5,84.9 v31.9,87.3 | 27.69,84.49 29.49,84.49 29.5,84.5 | v35.1,81.7 v31.5,81.7 | R49.2 v27.9,40.7 | R9.1 19.7,98 | R23.2 19.7,101.7 | DC14.1 41.85,80.55 v40.7,81.7 | IC3.5 6.85,68.05 5.35,69.55 DC20.1 5.35,71.75 v5.8,72.2 | DC19.1 14.15,70 C10.-
  Bottom 0.406: R45.1 14.89,44.09 IC2.5 | LM1117.1 11.6,78.31 | DC12.1 DC13.1 | 6.25,82.75 C4.- | DC12.1 11.75,81.2 LM1117.1 | LM1117.1 11.91,78 C3.- | C4.- 5.59,83.77 JP3.1 | DC12.1 8.25,81.35 6.05,83.55 C4.-
  Bottom 0.61: C1.- 13.95,23.4 v20.3,23.4 | IC1.5 40.9,65.5 | 40.9,65.5 40.9,62.1 | 40.9,62.1 IC1.3 | 40.9,62.1 41,62 41,54.1 v41,47.7 | v45.7,66.3 40.9,66.3 40.9,65.5
  Bottom 1.016: 11.1,48.8 5.1,48.8 5.1,45.4 | 11.1,48.8 IC2.3 17.8,48.8 D1.A | IC2.5 5.1,45.4 | JP7.2 11.1,48.8 | C10.- 18.43,64.62 | 18.43,64.62 18.55,64.5 v20,64.5 | C1.- 3.4,33.65 3.4,43.7 5.1,45.4 | v35.3,67.1 35.3,65.51 IC1.5 | 18.43,64.62 18.32,64.62 D11.A 14.6,60.9 14.5,60.9
  Bottom 1.27: 15.8,62.2 14.5,60.9 14.1,60.5 14.1,58.2 12.93,57.03 JP7.2
  other vias: 20.7,105 42.7,95.7 54.3,97.5 31.7,101.5 45.1,88.4 42.3,77.9
  pour Top (rank 2): 0,108.4 0,17.7 56.6,17.7 56.6,108.4
  pour Bottom: 0,108.4 0,17.7 56.6,17.7 56.6,108.4
N$1
  Top 0.406: DC15.1 19.35,35.15 U$2.SIM_GND 16.83,34.03 15,32.2 15,26.2 16.7,24.5 26.6,24.5 31.2,29.1 U2.31
N$2
  Top 0.406: U$2.SIM_VDD 20.52,32.77 DC15.2 23.55,33.25 27.7,37.4 U2.27
N$3
  Top 0.406: R10.1 25.6,31.3 26.8,32.5 26.8,34.7 28.4,36.3 U2.28
N$4
  Top 0.406: R11.1 26.1,27.7 29.1,30.7 29.1,33.6 29.6,34.1 U2.30
N$5
  Top 0.406: JP12.1 JP14.1 24.97,12.81 JP13.1
  Bottom 0.406: DC8.1 38.4,11.3 36.89,12.81 JP12.1
  pour Bottom: 20.8,17.7 20.8,0 41.6,0 41.6,17.7
  pour Top: 20.8,0 20.8,17.7 41.6,17.7 41.6,0
N$6
  Top 0.406: U$2.SIM_RST 19.43,30.23 20.5,31.3 R10.2
N$7
  Top 0.254: LED2.A 26.6,97.95 R25.1
N$8
  Top 0.254: JP5.4 46.84,102.04 45.3,100.5 45.3,99.4 44.2,98.3 42,98.3 40.6,96.9 U1.2
N$9
  Top 0.254: JP5.3 44.3,100.3 43.3,99.3 41.9,99.3 40.1,97.5 U1.3
N$10
  Bottom 0.254: U$1.SCK 18.46,95.84 R7.1 R24.2
N$11
  Top 0.254: JP3.4 13.5,86.8 14.7,85.6 14.7,84.7 15.7,83.7 18.5,83.7 19.6,82.6 R5.2
  Bottom 0.254: DC12.2 13.21,84.86 JP3.4
N$12
  Bottom 0.254: R6.1 R9.2 18.8,98.05 U$1.DIN
N$13  (via drill 0.6)
  Top 0.254: U1.30 26.1,91.3 25.7,91.7 25.7,96.4 25.3,96.8 19.6,96.8 | 19.6,96.8 19.6,91.6 18.5,90.5 18.5,89 19.1,88.4 19.6,88.4 20.1,87.9 20.1,86.8 19.5,86.2 16.9,86.2 16.2,86.9 16.2,88.5 15,89.7 2.8,89.7 v2.3,89.2 | 19.6,96.8 19.6,99.2 21.2,100.8 21.2,103.1 22.77,104.67 JP4.2 | JP5.2 41.76,105.06 42.5,105.8 51.3,105.8 R16.2
  Bottom 0.254: JP4.2 25.49,106 30.1,106 30.8,105.3 30.8,104.4 32.8,102.4 36.8,102.4 39.4,99.8 41.3,99.8 41.76,100.26 41.76,101.39 | JP5.2 41.76,101.39 | 41.76,101.39 DC11.1 | v2.3,89.2 2.3,71.75
N$14
  Top 0.406: JP12.4 33.11,5.19 32.2,6.1 32.2,9.3 31.23,10.27 JP14.2 27.67,10.27 26.5,9.1 26.5,7.5 25.46,6.46 JP13.3
  Bottom 0.406: DC8.2 38.4,6.3 37.29,5.19 JP12.4
N$15
  Bottom 0.406: JP13.2 25.7,9 26.97,7.73 JP14.3
N$16
  Top 0.254: JP4.3 31.1,97.73 U1.21
  Bottom 0.254: JP4.3 25.43,103.4 23,103.4 21.9,102.3 21.9,100.7 21.1,99.9 R6.2
N$17
  Top 0.254: JP4.5 29.24,100.86 31.6,98.5 U1.20
  Bottom 0.254: JP4.5 27.71,100.6 23.2,100.6 21.8,99.2 21.8,96.7 21.1,96 R7.2
N$18  (via drill 0.6)
  Top 0.254: U1.82 46.2,84.3 46.9,85 51.1,85 52.9,83.2 52.9,78.5 50.4,76 47.8,76 | v25.1,65.1 26.4,65.1 28.3,63.2 37,63.2 38.6,64.8 43.4,64.8 44.4,65.8 44.4,67.1 47.3,70 47.3,73.4 47.8,73.9 47.8,76 | R1.1 15,71.3 v18.6,67.7 | DC21.1 45.45,77.85 46.4,76.9 47.2,76.9 47.8,76.3 47.8,76
  Bottom 0.254: v25.1,65.1 24.2,66 20.3,66 v18.6,67.7
N$19
  Top 1.016: JP7.1 JP8.1
  Bottom 0.254: 7.9,63.3 7.85,63.35 IC3.4
  Bottom 1.27: JP7.1 10.13,59.57 7.9,61.8 7.9,63.3
  pour Top (no thermals): 17.9,61.8 arc-180 17.9,58.2 10.5,58.2 arc-180 10.5,61.8
N$20  (via drill 0.6)
  Top 0.254: U1.19 32.1,97.1 33,98 33,104.1 v33.7,104.8
  Bottom 0.254: v33.7,104.8 32.2,106.7 23,106.7 21.9,105.6 21.9,104.8 R8.2
N$21
  Top 0.61: U2.39 46.25,22.65 X1.1
N$22
  Top 0.254: R36.1 44,67.9 44,73.3 44.9,74.2 R22.2 44.7,76.4 44.2,76.9 44.2,78 42.9,79.3 U1.75
N$23
  Top 0.254: U1.44 25.7,84.3 24.6,83.2 24.6,80.4 24.3,80.1 R5.1
N$25
  Top 0.254: JP9.1 4.07,59.57 2.9,58.4 2.9,55.9 4,54.8 R26.1
  Bottom 1.27: D3.A 3.71,60.76 JP9.1
N$26
  Top 0.254: R28.1 25.25,76.75 LED3.A
N$27
  Top 0.254: R26.2 LED4.A
N$28  (via drill 0.6)
  Top 0.254: R1.2 9.9,71.5 9.85,71.45 v9.2,70.8
  Bottom 0.254: IC3.7 9.73,70.27 v9.2,70.8
N$29
  Top 0.406: U$2.SIM_CLK 18.25,27.7 R11.2
N$30
  Top 0.254: U1.33 23.54,89.8 O1.2
  Bottom 0.406: C7.2 24.76,90.64 O1.2
N$31
  Top 0.254: U1.34 25.3,89.3 22.7,86.7 O1.1
  Bottom 0.406: C8.2 24.67,85.56 O1.1
N$32
  Top 0.254: JP3.3 10.67,87.67 12,89 14.3,89 15.1,88.2 15.1,86.6 15.7,86 15.7,85.4 16.1,85 18.9,85 20.9,83 20.9,82.1 R30.2
  Bottom 0.254: JP3.3 10.67,86.07 9,84.4 DC13.2
N$33
  Top 0.254: R28.2 27.4,80.2 28.3,79.3 U1.51
N$34
  Top 0.254: LED1.A 27.75,76.75 29,75.5 R27.1
N$35
  Bottom 0.254: R23.1 R8.1 17.4,103.5 14.6,100.7 14.6,99.7 15.16,99.14 U$1.CS
N$36
  Top 0.254: U1.13 35.1,96.8 34.6,97.3 R12.1
N$37  (via drill 0.6)
  Top 0.254: R13.2 36.3,105.3 34.9,106.7 18.2,106.7 16.6,105.1 16.6,89 17.1,88.5 17.1,87.7 v17.3,87.5 | v15.5,82.4 14.02,80.92 U3.2
  Bottom 0.254: v17.3,87.5 17.3,84.2 v15.5,82.4
N$38  (via drill 0.6)
  Top 0.254: v18.9,87.5 17.6,88.8 17.6,103.9 19.8,106.1 34,106.1 34.7,105.4 34.7,103.1 R12.2 | U3.1 16.56,81.36 v17.6,82.4
  Bottom 0.254: 18.9,84.3 18.9,83.7 v17.6,82.4 | 18.9,84.3 v18.9,87.5 | R4.2 18.9,84.3
N$39
  Top 0.254: R25.2 29.1,96.6 U1.25
N$40
  Top 0.254: U1.46 26.2,83.3 25.7,82.8 25.7,79.8 23,77.1 R14.2
N$41
  Top 0.254: U1.45 26,83.8 25.1,82.9 25.1,80.1 24,79 R15.2
N$42
  Top 0.254: R29.2 R14.1 20.2,76.3 18.9,76.3 18.3,75.7 18.3,71.2 23.8,65.7 23.8,55.3 U2.21
N$43
  Top 0.254: R15.1 19.2,79 17.2,77 17.2,70.9 21.8,66.3 21.8,53.6 28.6,46.8 U2.22
N$44
  Top 0.254: U1.74 40.6,76.5 | 40.6,76.5 R19.2 | 40.6,76.5 R34.1
N$45
  Top 0.254: JP5.5 49.38,101.42 50,100.8 R39.2
N$46
  Bottom 0.406: JP12.3 33.43,7.73 30.89,5.19 JP14.4
N$47
  Top 0.254: R31.2 51.1,98.8 R20.1 50.3,97.3 49.7,96.7 49,96.7 48.4,96.1 48.4,93.9 45.8,91.3 U1.96
N$48
  Top 0.254: R27.2 30.5,77.3 31.1,77.9 U1.55
N$49
  Top 0.254: U1.22 30.6,96.8 27.8,99.6 26.69,99.6 JP4.1 22.13,102.13 R35.1
N$50
  Top 0.254: R17.2 47.4,55.3 46.25,54.15 U2.13
N$51
  Top 0.254: R17.1 45.5,57.6 LED6.A
N$52
  Top 0.254: JP6.1 45.31,71.81 46.7,73.2 R22.1
N$53
  Top 0.254: R21.1 48.3,91.1 49.34,90.06 JP1.1
N$54
  Top 0.254: U1.94 45.6,90.3 46.6,89.3 R21.2 | R21.2 47.55,89.3 | DC17.1 47.65,89.3 R21.2
N$55
  Top 0.254: R30.1 23.5,82.9 25.4,84.8 U1.43
N$56
  Top 0.254: JP6.2 42.77,74.73 R19.1
N$57
  Top 0.254: R31.1 52.1,96.44 JP1.3
N$58
  Top 0.254: R32.2 34.7,73.5 31.5,73.5 30.47,72.47 JP2.2
N$60
  Top 0.254: R18.1 LED5.A
N$61
  Bottom 0.254: JP10.2 50.8,79.1 R41.1
N$62
  Top 0.254: U1.63 35.1,77.3 R32.1
N$63
  Top 0.254: JP2.1 34.7,71.2 38,74.5 R33.2
N$64  (via drill 0.6)
  Top 0.254: R35.2 18.7,100.5 v18.7,92.4
  Bottom 0.254: U$1.DOUT 17.24,93.66 17.5,93.4 17.5,92.8 17.9,92.4 v18.7,92.4
N$65
  Bottom 0.813: D11.K 27.8,62.2 L6.1 28.7,61.2 L4.1 29.5,60.4 IC1.2
N$66
  Top 0.254: U1.64 35.6,78.3 36.2,77.7 37.3,77.7 38,77 R33.1
N$67
  Top 0.406: U$2.SIM_DATA 20.06,28.96 20.6,29.5 R47.2
N$68
  Top 0.406: R47.1 26,29.5 28,31.5 28,34.4 28.8,35.2 U2.29
N$69
  Bottom 0.254: U4.1 29.7,49.28 R50.2 29.1,48.5 27.9,47.3 R49.1
N$70
  Top 0.254: R13.1 35.2,100.1 35.2,97.6 35.6,97.2 U1.12
N$71
  Top 0.254: U1.1 41.1,95.9 42.4,97.2 44.4,97.2 45.9,98.7 R40.2 47,98.6 R39.1
N$72
  Top 0.406: JP16.1 4.17,12.71 JP17.1 JP15.1
  Bottom 0.406: JP15.1 15.99,12.71 17.7,11 DC9.1
  pour Bottom: 0,17.7 0,0 20.8,0 20.8,17.7
  pour Top: 0,17.7 0,0 20.8,0 20.8,17.7
N$73
  Bottom 0.254: JP10.1 50.8,85.75 T3.1
N$74
  Bottom 0.254: R42.1 50.85,87.8 T3.2
N$75  (via drill 0.6)
  Top 0.254: U1.85 44.4,85.8 46.3,87.7 v47,87.7
  Bottom 0.254: DC14.2 47.85,82.45 49.2,83.8 R42.2 48.7,86 v47,87.7
N$76
  Top 0.254: U1.83 45.4,84.8 46.4,85.8 51.3,85.8 53.6,83.5 53.6,77.8 50.8,75 49.8,75 48.2,73.4 R44.2 48.2,66.9 R43.2
N$77
  Bottom 1.016: IC2.2 20.8,50.5 D1.K 22.4,49.9 26,46.3 26,39.3 | 24.3,37.3 L2.1 24.7,37.2 26,38.5 26,39.3 | L3.1 26,39.3
N$78
  Bottom 0.406: IC2.4 16.7,47.1 17.4,46.4 17.4,43.2 16.4,42.2 R45.2 | 15.4,42.2 R45.2 | R45.2 R46.1
N$79  (via drill 0.6)
  Top 0.254: R44.1 v53.6,63.4
  Bottom 0.254: v53.6,63.4 51.3,61.1 T4.3
N$80  (via drill 0.6)
  Top 0.254: R48.1 54.8,85.4 v54.8,84.1
  Bottom 0.254: T4.1 54.8,62.25 v54.8,84.1
N$81
  Top 0.254: R48.2 54,87.6 52.9,86.5 46.1,86.5 44.9,85.3 U1.84
N$82
  Top 0.406: JP16.3 4.66,6.36 5.8,7.5 5.8,8.8 7.17,10.17 JP17.2 10.43,10.17 11.6,9 11.6,6.2 12.71,5.09 JP15.4
  Bottom 0.406: DC9.2 17.7,6.7 16.09,5.09 JP15.4
N$83
  Bottom 0.406: JP17.4 10.39,5.09 12.93,7.63 JP15.3
N$84
  Bottom 0.406: JP16.2 5.4,8.9 6.67,7.63 JP17.3
N$90
  Bottom 0.254: 10.3,63.3 10.35,63.35 IC3.1
  Bottom 1.27: D3.K 5.62,65.5 9,65.5 10.3,64.2 10.3,63.3
N$91
  Bottom 0.254: DC20.2 8.46,69.08 IC3.6
VDD  (via drill 0.6)
  Top 0.254: 36.6,94.1 41.2,94.1 42,93.3 U1.100 43.1,94.1 44.1,95.1 DC2.1 44.95,95.75 46,96.8 R40.1 47.3,96.8 R20.2 | 36.6,94.1 U1.10 36.6,96.4 37.1,96.9 37.7,96.9 38.35,97.55 DC5.1 | 36.6,94.1 28.7,94.1 28.3,93.7 28.3,90.8 | 28.3,90.8 U1.31 25.7,90.8 25,91.5 25,94.65 DC4.1 23.9,95 | 34.1,80.5 U1.61 34.1,78.2 31.65,75.75 DC1.1 | DC3.1 47.05,80.35 44.1,83.3 U1.80 42.1,83.3 41.9,83.1 41.9,80.9 41.5,80.5 34.1,80.5 | 34.1,80.5 28.7,80.5 28.3,80.9 28.3,88.3 | 28.3,88.3 28.3,90.8 | v29.4,88.3 28.3,88.3
  Bottom 0.254: v29.4,88.3 L1.2 34.15,88.3
  Bottom 0.406: L1.2 36.15,88.3 DC18.2
  Bottom 0.61: 36.1,88.25 DC18.2
(copper drawn outside any net)
  shapes: Bottom area x2

### Text on the board
tPlace: L-80
tNames: C | GND | Tx | Rx | RI | B | RST | A | GND | S | GND | IIC | +5 | SCL | SDA | F | GND | +5 | Tx | Rx | 3.3 | GND | M | D | A | E | OUT | DHT | OUT | DHT | MET | GND | MET | GND | VDD | VDD | MET | MET | DHT | DHT